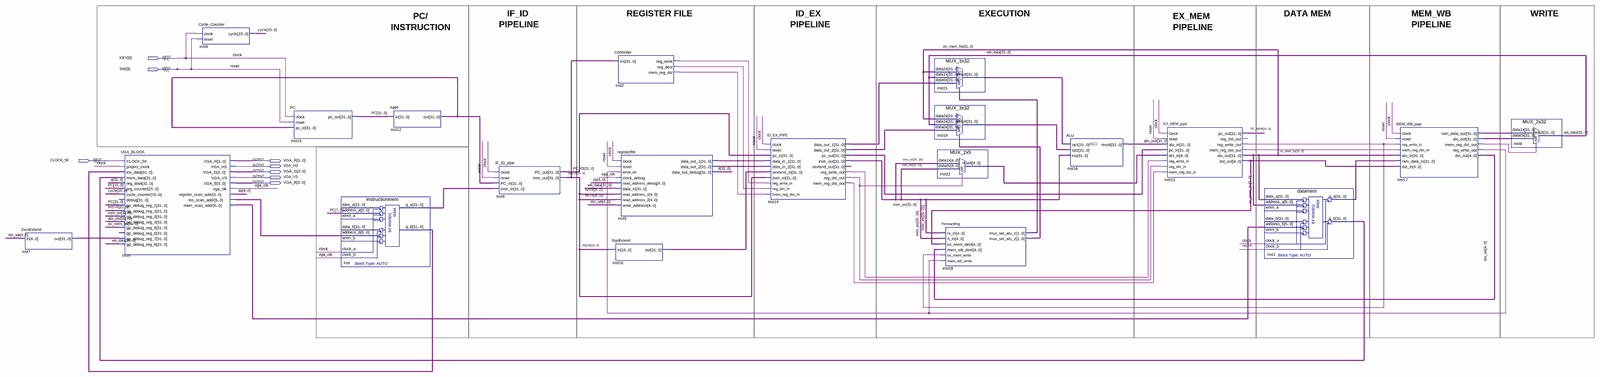
[diagram p0: schematic sheet, whole]
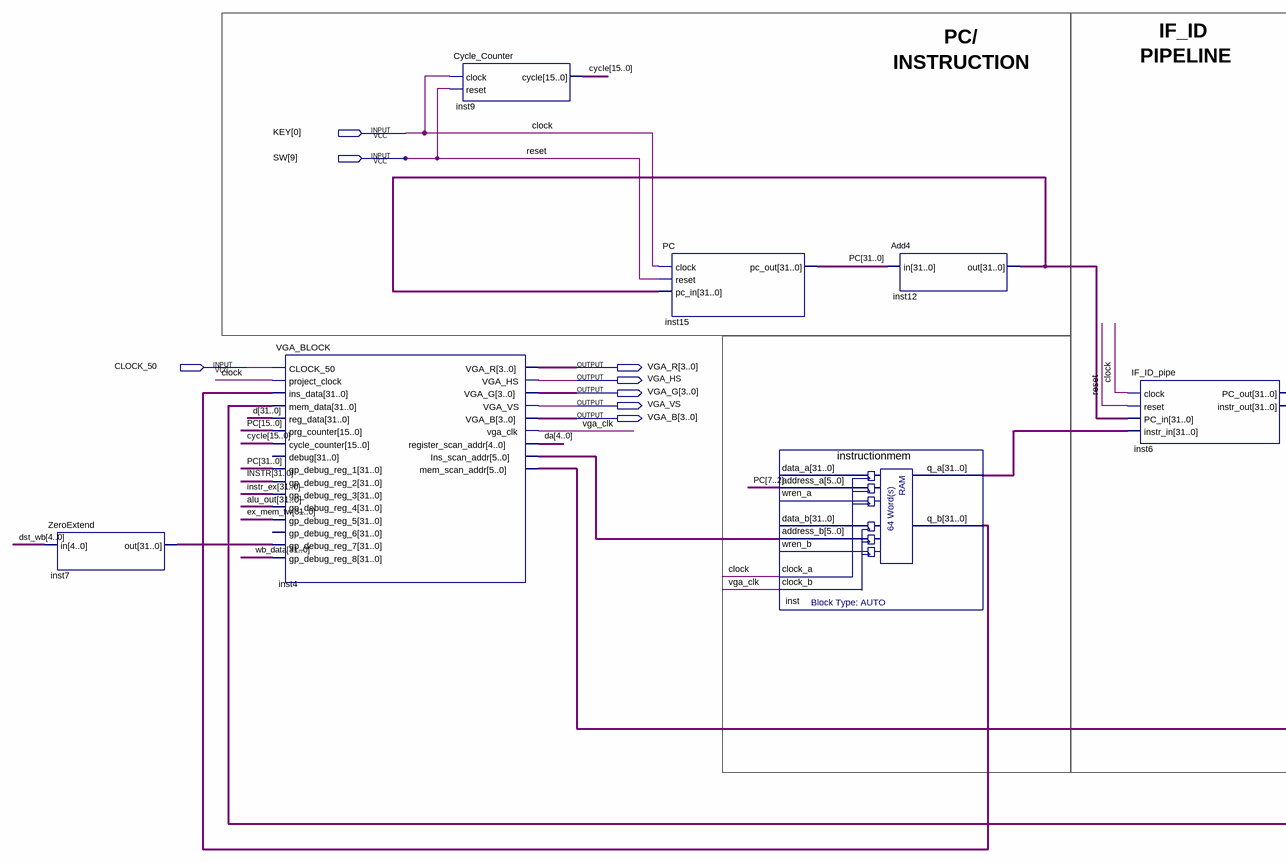
[diagram p1: schematic sheet, left part]
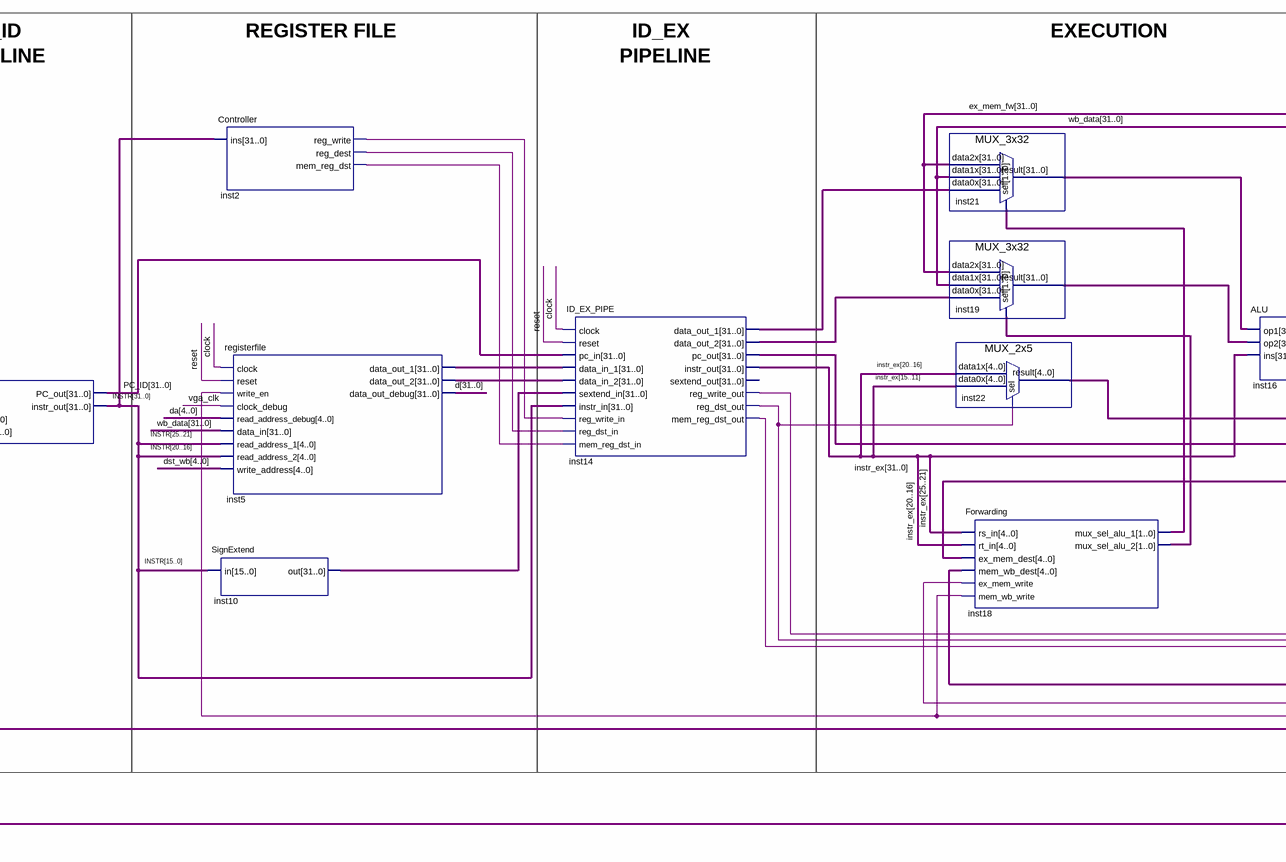
[diagram p2: schematic sheet, centre part]
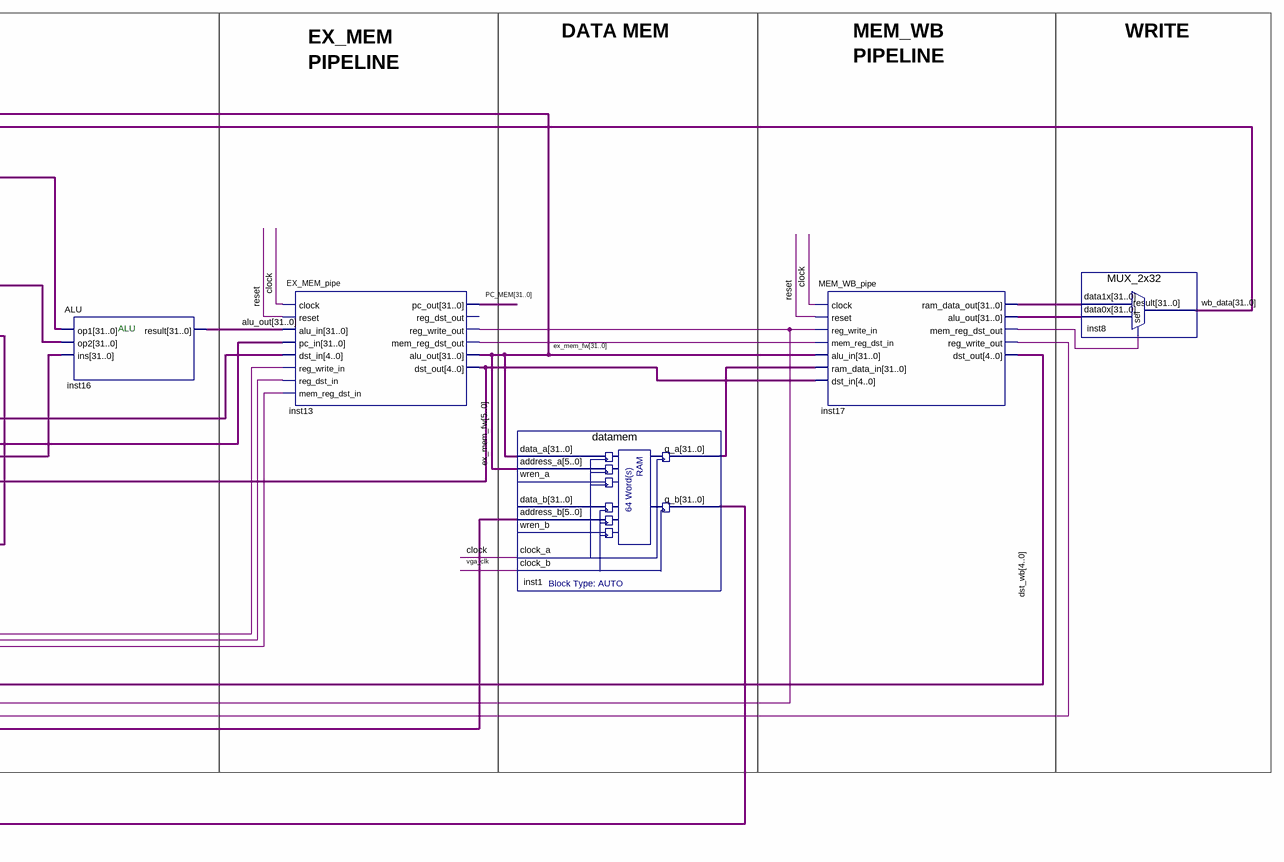
[diagram p3: schematic sheet, right part]
// Quartus schematic VGADEMO.bdf as structural Verilog: 20 symbols, 8 pins
module VGADEMO (
  input  [0:0] KEY,
  input  [9:9] SW,
  input  CLOCK_50,
  output [3:0] VGA_R,
  output VGA_HS,
  output [3:0] VGA_G,
  output VGA_VS,
  output [3:0] VGA_B
);

  wire inst2_mem_reg_dst, inst2_reg_dest, inst2_reg_write, inst13_mem_reg_dst_out, inst13_reg_write_out,
       inst14_mem_reg_dst_out, inst14_reg_dst_out, inst14_reg_write_out, inst17_mem_reg_dst_out,
       inst17_reg_write_out, vga_clk;
  wire [1:0] inst18_mux_sel_alu_1, inst18_mux_sel_alu_2;
  wire [4:0] da, dst_wb, inst13_dst_out, inst22_result;
  wire [5:0] inst4_ins_scan_addr, inst4_mem_scan_addr;
  wire [15:0] cycle;
  wire [31:0] alu_out, d, ex_mem_fw, inst1_q_a, inst1_q_b, inst5_data_out_1, inst5_data_out_2, inst7_out,
       inst10_out, inst12_out, inst14_data_out_1, inst14_data_out_2, inst14_pc_out, inst17_alu_out,
       inst17_ram_data_out, inst19_result, inst21_result, inst_q_a, inst_q_b, INSTR, instr_ex, PC, PC_ID,
       PC_MEM, wb_data;

  ZeroExtend inst7 (.in(dst_wb), .out(inst7_out));
  VGA_BLOCK inst4 (
    .CLOCK_50(CLOCK_50), .project_clock(KEY[0]), .ins_data(inst_q_b), .mem_data(inst1_q_b), .reg_data(d),
    .prg_counter(PC[15:0]), .cycle_counter(cycle), .gp_debug_reg_1(PC), .gp_debug_reg_2(INSTR),
    .gp_debug_reg_3(instr_ex), .gp_debug_reg_4(alu_out), .gp_debug_reg_5(ex_mem_fw),
    .gp_debug_reg_7(inst7_out), .gp_debug_reg_8(wb_data), .VGA_R(VGA_R), .VGA_HS(VGA_HS), .VGA_G(VGA_G),
    .VGA_VS(VGA_VS), .VGA_B(VGA_B), .vga_clk(vga_clk), .register_scan_addr(da),
    .Ins_scan_addr(inst4_ins_scan_addr), .mem_scan_addr(inst4_mem_scan_addr));  // open: debug, gp_debug_reg_6
  Cycle_Counter inst9 (.clock(KEY[0]), .reset(SW[9]), .cycle(cycle));
  PC inst15 (.clock(KEY[0]), .reset(SW[9]), .pc_in(inst12_out), .pc_out(PC));
  instructionmem inst (
    .address_a(PC[7:2]), .address_b(inst4_ins_scan_addr), .clock_a(KEY[0]), .clock_b(vga_clk),
    .q_a(inst_q_a), .q_b(inst_q_b));  // open: data_a, wren_a, data_b, wren_b
  Add4 inst12 (.in(PC), .out(inst12_out));
  IF_ID_pipe inst6 (
    .clock(KEY[0]), .reset(SW[9]), .PC_in(inst12_out), .instr_in(inst_q_a), .PC_out(PC_ID), .instr_out(INSTR));
  Controller inst2 (
    .ins(INSTR), .reg_write(inst2_reg_write), .reg_dest(inst2_reg_dest), .mem_reg_dst(inst2_mem_reg_dst));
  SignExtend inst10 (.in(INSTR[15:0]), .out(inst10_out));
  registerfile inst5 (
    .clock(KEY[0]), .reset(SW[9]), .write_en(inst17_reg_write_out), .clock_debug(vga_clk),
    .read_address_debug(da), .data_in(wb_data), .read_address_1(INSTR[25:21]), .read_address_2(INSTR[20:16]),
    .write_address(dst_wb), .data_out_1(inst5_data_out_1), .data_out_2(inst5_data_out_2), .data_out_debug(d));
  ID_EX_PIPE inst14 (
    .clock(KEY[0]), .reset(SW[9]), .pc_in(PC_ID), .data_in_1(inst5_data_out_1), .data_in_2(inst5_data_out_2),
    .sextend_in(inst10_out), .instr_in(INSTR), .reg_write_in(inst2_reg_write), .reg_dst_in(inst2_reg_dest),
    .mem_reg_dst_in(inst2_mem_reg_dst), .data_out_1(inst14_data_out_1), .data_out_2(inst14_data_out_2),
    .pc_out(inst14_pc_out), .instr_out(instr_ex), .reg_write_out(inst14_reg_write_out),
    .reg_dst_out(inst14_reg_dst_out), .mem_reg_dst_out(inst14_mem_reg_dst_out));  // open: sextend_out
  MUX_3x32 inst21 (
    .data2x(ex_mem_fw), .data1x(wb_data), .data0x(inst14_data_out_1), .sel(inst18_mux_sel_alu_1),
    .result(inst21_result));
  MUX_3x32 inst19 (
    .data2x(ex_mem_fw), .data1x(wb_data), .data0x(inst14_data_out_2), .sel(inst18_mux_sel_alu_2),
    .result(inst19_result));
  MUX_2x5 inst22 (.data1x(instr_ex[20:16]), .data0x(instr_ex[15:11]), .sel(inst14_reg_dst_out), .result(inst22_result));
  Forwarding inst18 (
    .rs_in(instr_ex[25:21]), .rt_in(instr_ex[20:16]), .ex_mem_dest(inst13_dst_out), .mem_wb_dest(dst_wb),
    .ex_mem_write(inst13_reg_write_out), .mem_wb_write(inst17_reg_write_out),
    .mux_sel_alu_1(inst18_mux_sel_alu_1), .mux_sel_alu_2(inst18_mux_sel_alu_2));
  ALU inst16 (.op1(inst21_result), .op2(inst19_result), .ins(instr_ex), .result(alu_out));
  EX_MEM_pipe inst13 (
    .clock(KEY[0]), .reset(SW[9]), .alu_in(alu_out), .pc_in(inst14_pc_out), .dst_in(inst22_result),
    .reg_write_in(inst14_reg_write_out), .reg_dst_in(inst14_reg_dst_out),
    .mem_reg_dst_in(inst14_mem_reg_dst_out), .pc_out(PC_MEM), .reg_write_out(inst13_reg_write_out),
    .mem_reg_dst_out(inst13_mem_reg_dst_out), .alu_out(ex_mem_fw), .dst_out(inst13_dst_out));  // open: reg_dst_out
  datamem inst1 (
    .data_a(ex_mem_fw), .address_a(ex_mem_fw[5:0]), .address_b(inst4_mem_scan_addr), .clock_a(KEY[0]),
    .clock_b(vga_clk), .q_a(inst1_q_a), .q_b(inst1_q_b));  // open: wren_a, data_b, wren_b
  MEM_WB_pipe inst17 (
    .clock(KEY[0]), .reset(SW[9]), .reg_write_in(inst13_reg_write_out),
    .mem_reg_dst_in(inst13_mem_reg_dst_out), .alu_in(ex_mem_fw), .ram_data_in(inst1_q_a),
    .dst_in(inst13_dst_out), .ram_data_out(inst17_ram_data_out), .alu_out(inst17_alu_out),
    .mem_reg_dst_out(inst17_mem_reg_dst_out), .reg_write_out(inst17_reg_write_out), .dst_out(dst_wb));
  MUX_2x32 inst8 (
    .data1x(inst17_ram_data_out), .data0x(inst17_alu_out), .sel(inst17_mem_reg_dst_out), .result(wb_data));

  // Other names for the same wires on the sheet: clock = KEY[0]; reset = SW[9]

  // Notes on the sheet:
  //   IF_ID
  //   REGISTER FILE
  //   ID_EX
  //   EXECUTION
  //   DATA MEM
  //   MEM_WB
  //   WRITE
  //   PC/
  //   EX_MEM
  //   PIPELINE
  //   PIPELINE
  //   PIPELINE
  //   INSTRUCTION
  //   PIPELINE
  //   ALU
endmodule
